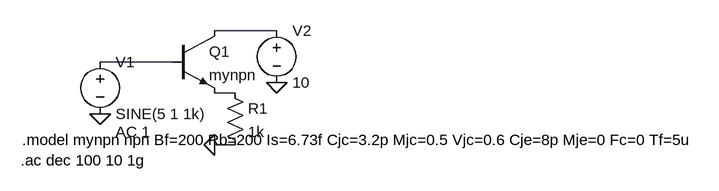
[diagram p0: schematic example-npn-model.asc]
example-npn-model.asc, the LTspice schematic file:
Version 4
SHEET 1 1140 680
WIRE 288 64 192 64
WIRE 128 112 16 112
WIRE 224 160 192 160
WIRE 224 240 192 240
FLAG 192 240 0
FLAG 288 144 0
FLAG 16 192 0
SYMBOL npn 128 64 R0
SYMATTR InstName Q1
SYMATTR Value mynpn
SYMBOL res 208 144 R0
SYMATTR InstName R1
SYMATTR Value 1k
SYMBOL voltage 16 96 R0
WINDOW 123 24 124 Left 2
WINDOW 39 0 0 Left 2
SYMATTR InstName V1
SYMATTR Value SINE(5 1 1k)
SYMATTR Value2 AC 1
SYMBOL voltage 288 48 R0
SYMATTR InstName V2
SYMATTR Value 10
TEXT -104 232 Left 2 !.model mynpn npn Bf=200 Rb=200 Is=6.73f Cjc=3.2p Mjc=0.5 Vjc=0.6 Cje=8p Mje=0 Fc=0 Tf=5u
TEXT -106 264 Left 2 !.ac dec 100 10 1g

The netlist it stands for:
* example-npn-model.asc
Q1 N001 N002 N003 0 mynpn
R1 N003 0 1k
V1 N002 0 SINE(5 1 1k) AC 1
V2 N001 0 10
.model NPN NPN
.model PNP PNP
.lib standard.bjt
.model mynpn npn Bf=200 Rb=200 Is=6.73f Cjc=3.2p Mjc=0.5 Vjc=0.6 Cje=8p Mje=0 Fc=0 Tf=5u
.ac dec 100 10 1g
.backanno
.end